# Altium schematic sheet AnalogConnector.SchDoc
size A4; Author: Esteban Durán Madrid; CompanyName: Universidad de Santiago de Chile; Address1: Avenida Ecuador Nº 3519; Address2: Estación Central, Santiago; Address3: Chile; DocumentNumber: 4; SheetNumber: 4; SheetTotal: 17
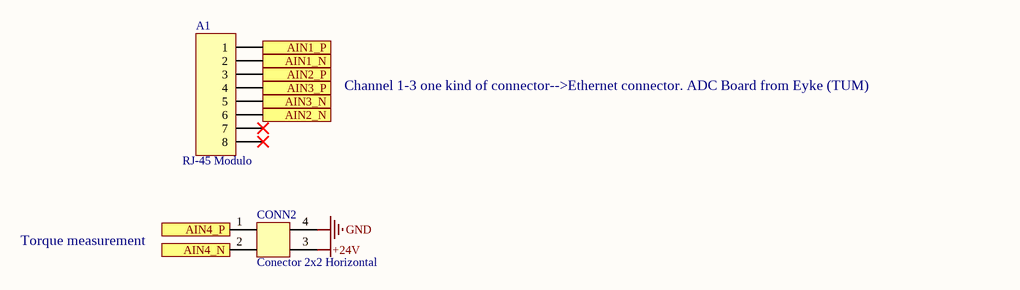
[diagram p0: AnalogConnector.SchDoc]

## Parts
A1  RJ-45 Modulo  [RJ45 - 1x1]
CONN2  Conector 2x2 Horizontal  [Conector 2x2 TH Horizontal]

## Ports
AIN1_N (out), AIN1_P (out), AIN2_N (out), AIN2_P (out), AIN3_N (out), AIN3_P (out), AIN4_N (out), AIN4_P (out)

## Nets
+24V: CONN2.3
GND: CONN2.4
AIN1_N: A1.2 ; port AIN1_N
AIN1_P: A1.1 ; port AIN1_P
AIN2_N: A1.6 ; port AIN2_N
AIN2_P: A1.3 ; port AIN2_P
AIN3_N: A1.5 ; port AIN3_N
AIN3_P: A1.4 ; port AIN3_P
AIN4_N: CONN2.2 ; port AIN4_N
AIN4_P: CONN2.1 ; port AIN4_P

Not connected (* = marked no-connect by the designer): A1 7* 8*

## Notes on the sheet
- Channel 1-3 one kind of connector-->Ethernet connector. ADC Board from Eyke (TUM)
- Torque measurement
- Title
- Size:
- Date:
- A4
- Revision:
- Time:
- Sheet
- of
- Author:
- Project:

## Library data of the parts
A1 = RJ45 1 modulo Horizontal: Modulo RJ-45 modulo Horizontal; Manufacturer Part-Number: 1-5406299-1; LatestRevisionDate: 17-Jul-2002; LatestRevisionNote: Re-released for DXP Platform.; Publisher: Altium Limited; Digikey Part-Number: A121568-ND
CONN2 = Conector 2x2 Horizontal: CONN HEADER R/A 4 POS 2.54MM Through Hole; Manufacturer Part-Number: IPL1-102-01-L-D-RA-K; Digikey Part-Number: SAM8823-ND